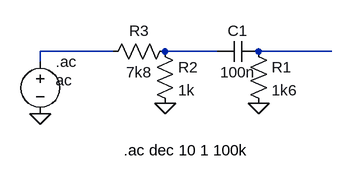
[diagram p0: schematic benadering_frequentie_responsie.asc]
benadering_frequentie_responsie.asc, the LTspice schematic file:
Version 4
SHEET 1 880 680
WIRE -48 96 -160 96
WIRE 112 96 32 96
WIRE 288 96 176 96
WIRE -160 112 -160 96
FLAG 176 176 0
FLAG -160 192 0
FLAG 32 176 0
SYMBOL res 160 80 R0
SYMATTR InstName R1
SYMATTR Value 1k6
SYMBOL cap 176 80 R90
WINDOW 0 0 32 VBottom 2
WINDOW 3 32 32 VTop 2
SYMATTR InstName C1
SYMATTR Value 100n
SYMBOL voltage -160 96 R0
WINDOW 3 24 44 Left 2
WINDOW 123 0 0 Left 0
WINDOW 39 0 0 Left 0
SYMATTR InstName .ac
SYMATTR Value ac
SYMBOL res 16 80 R0
SYMATTR InstName R2
SYMATTR Value 1k
SYMBOL res 48 80 R90
WINDOW 0 0 56 VBottom 2
WINDOW 3 32 56 VTop 2
SYMATTR InstName R3
SYMATTR Value 7k8
TEXT -32 248 Left 2 !.ac dec 10 1 100k

The netlist it stands for:
* benadering_frequentie_responsie.asc
R1 N003 0 1k6
C1 N003 N002 100n
V§.ac N001 0 ac
R2 N002 0 1k
R3 N002 N001 7k8
.ac dec 10 1 100k
.backanno
.end